# EAGLE board jr-support_v4 (EAGLE 8.2.2)
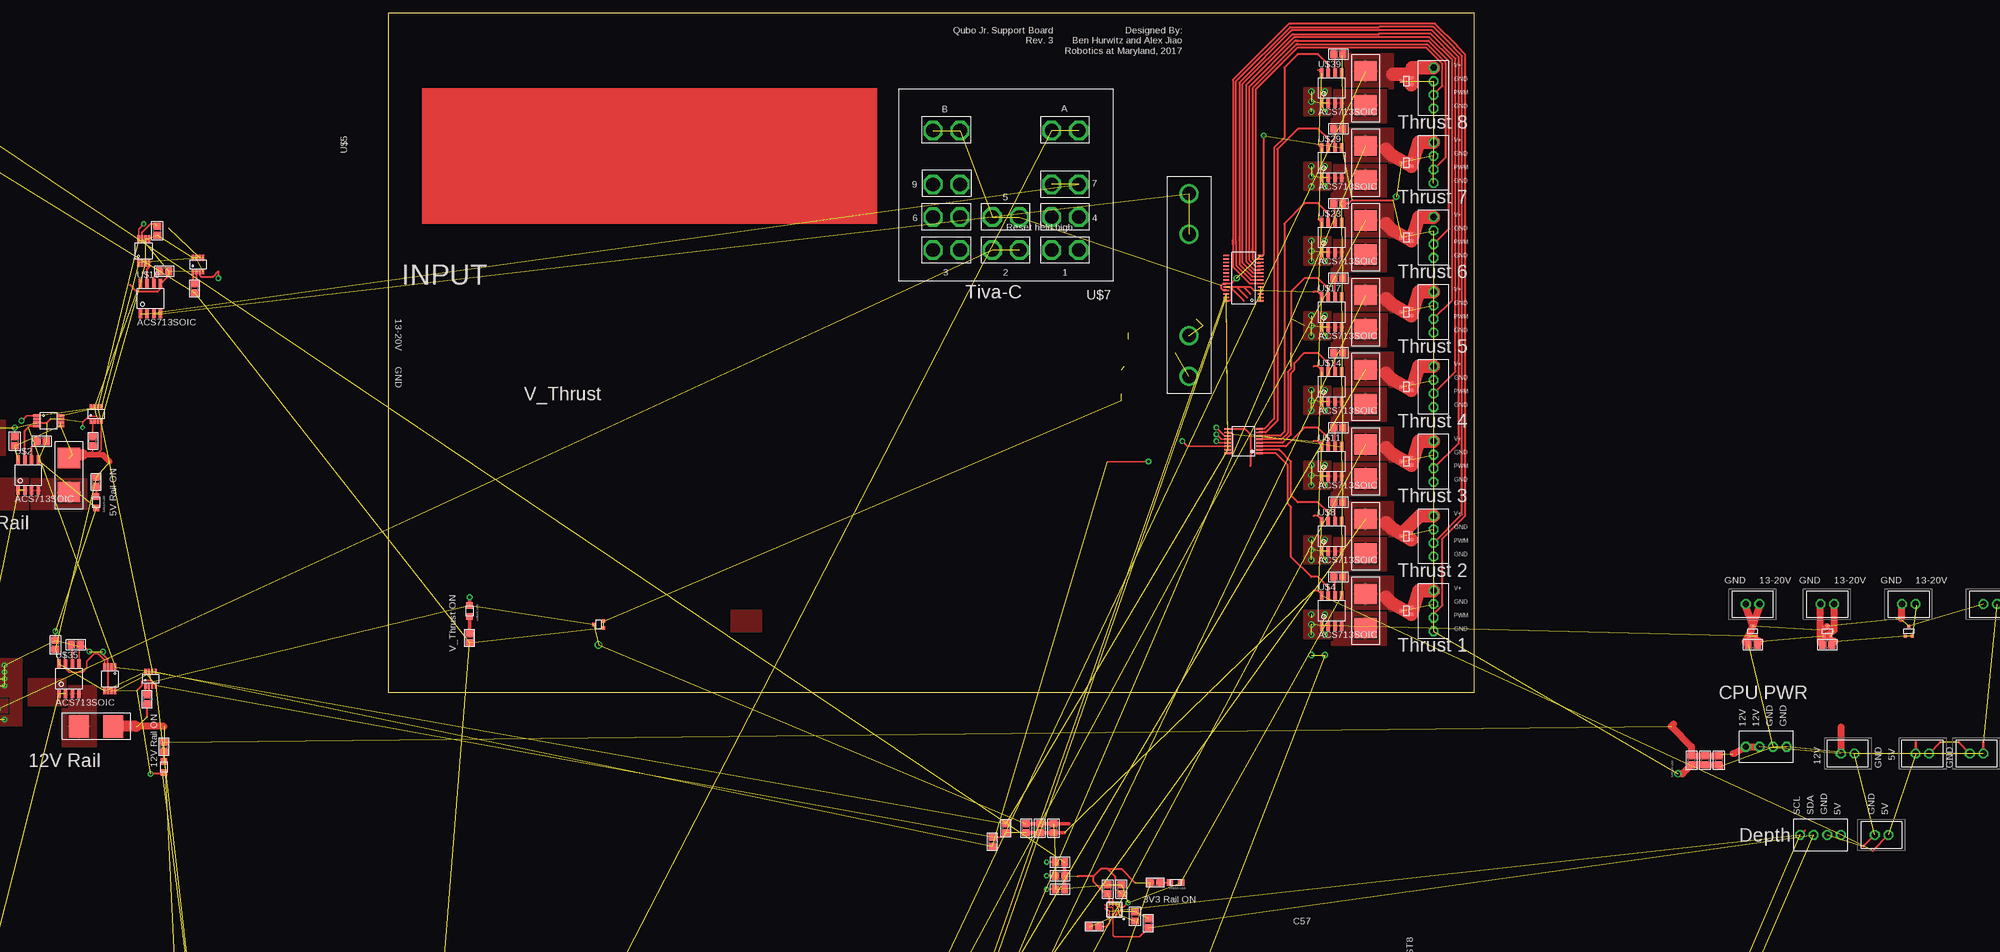
[diagram p9: board, top side]
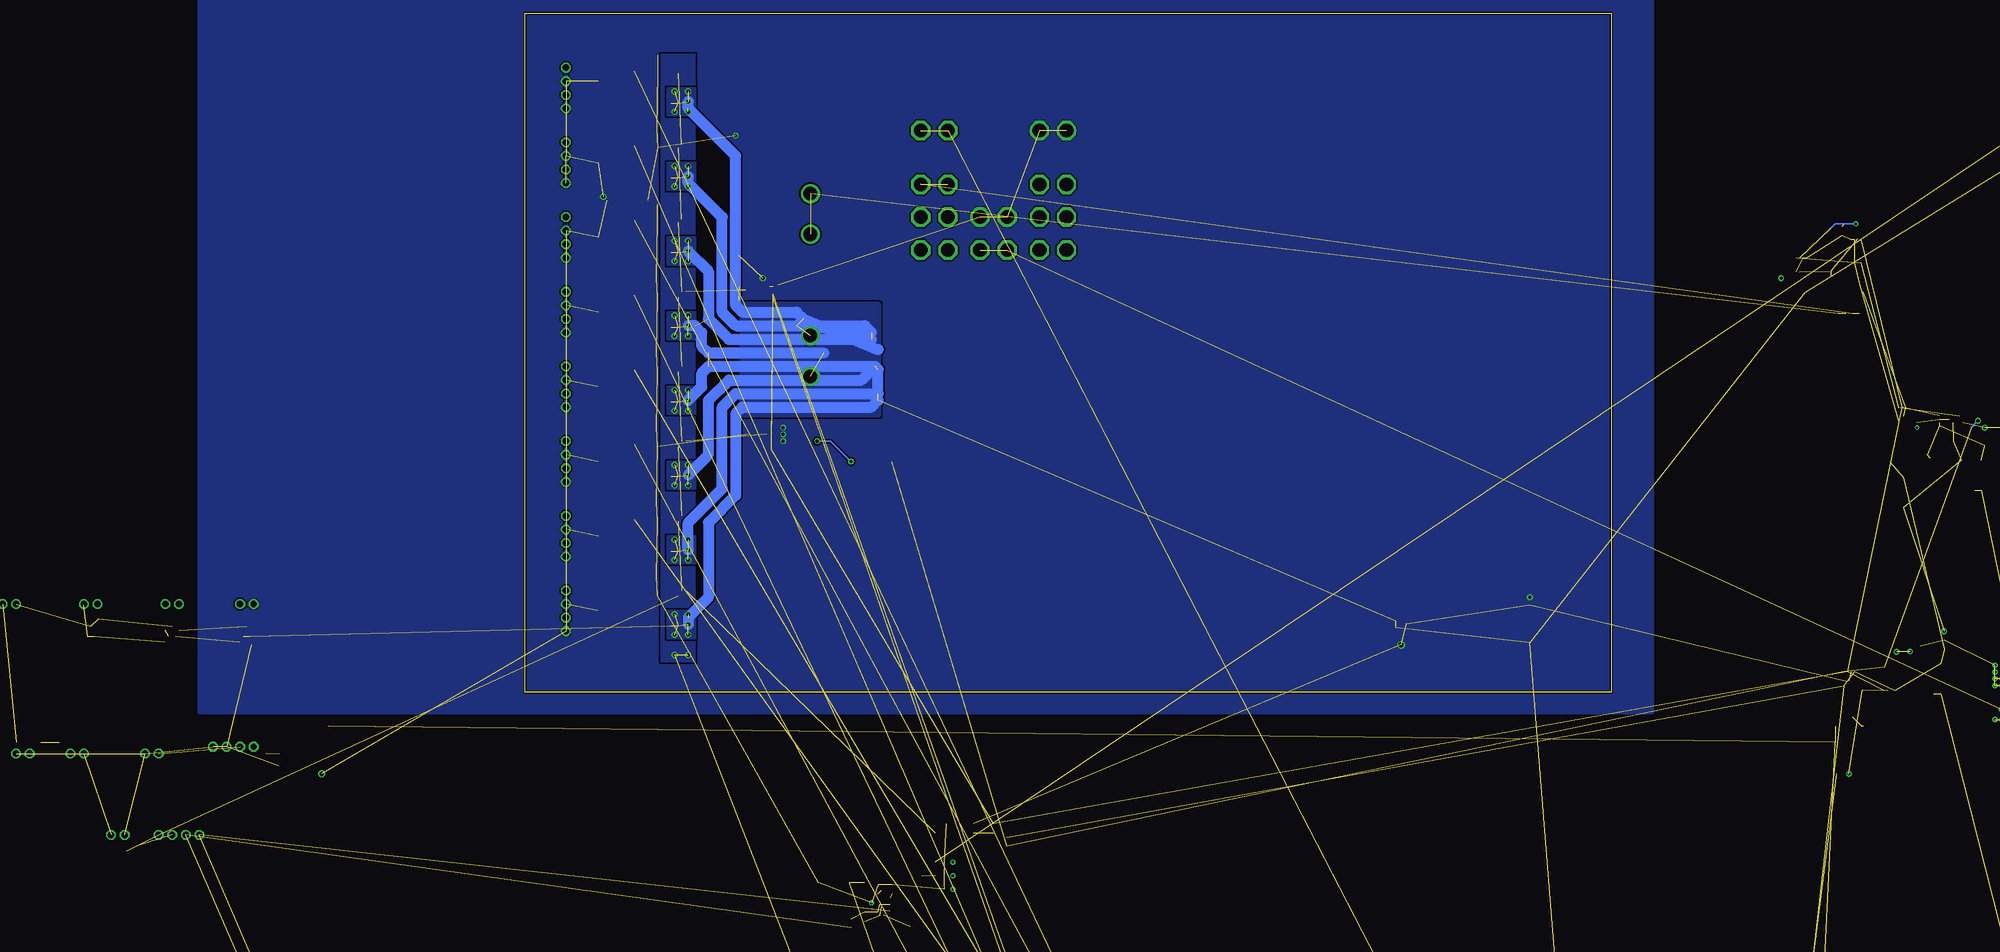
[diagram p10: board, bottom side, seen from below]

Size 203.18 x 127 mm. Coordinates in mm from the lower left corner, seen from the top.
Outline: 0,0 203.18,0 203.18,127 0,127 0,0
Copper layers (1*16): Top 0.035mm / dielectric 1.5mm / Bottom 0.035mm
Design rules "SparkFun *": minimum track width 8mil, minimum drill 15mil, track to track 8mil, track to pad 8mil, pad to pad 8mil, via to via 8mil, smd to smd 8mil, copper to edge 8mil, drill to drill 7mil, minimum pad ring 12mil, minimum via ring 10mil, stop-mask expansion 4mil, vias tented up to drill 20mil, thermal gap 10mil

## Footprints (pad centres in the part's own frame; a part is rotated, then mirrored left to right if it is on the bottom)
KK254_VERT_2PIN = drill 1.2 octagon: P$1 1.27,0; P$2 -1.27,0
0805 = smd 1.2 x 1.2: P$1 -1.05,0; P$2 1.05,0
VSSOP-8 = smd 0.42 x 1.45: P$1 -0.975,-2.2; P$2 -0.325,-2.2; P$3 0.325,-2.2; P$4 0.975,-2.2; P$5 0.975,2.2; P$6 0.325,2.2; P$7 -0.325,2.2; P$8 -0.975,2.2
SOT-23-8 = smd 0.45 x 1.1: P$1 -0.975,-1.3; P$2 -0.325,-1.3; P$3 0.325,-1.3; P$4 0.975,-1.3; P$5 0.975,1.3; P$6 0.325,1.3; P$7 -0.325,1.3; P$8 -0.975,1.3
BME280_LGA = smd 0.5 x 0.35: P$1 1.025,0.975; P$2 1.025,0.325; P$3 1.025,-0.325; P$4 1.025,-0.975; P$5 -1.025,-0.975; P$6 -1.025,-0.325; P$7 -1.025,0.325; P$8 -1.025,0.975
C0805 = smd 1.3 x 1.5: 1 -0.85,0; 2 0.85,0
CKR_D10 = drill 0.8 square: P$1 -2.5,0 | drill 0.8: P$2 2.5,0
140CLH-0810 = smd 3.5 x 2.5: + 3.25,0; - -3.25,0
C1210 = smd 1.6 x 2.7: 1 -1.4,0; 2 1.4,0
KK254_VERT_4PIN = drill 1.2 octagon: P$1 3.81,0; P$2 1.27,0; P$3 -1.27,0; P$4 -3.81,0
JP1 = drill 0.914 long: 1 0,-1.27; 2 0,1.27
1X02 = drill 1.016: 1 -1.27,0; 2 1.27,0
CHIPLED_0805 = smd 1.2 x 1.2: A 0,-1.05; C 0,1.05
SOT-346-3/S-MINI = smd 0.6 x 0.8: P$1 -0.95,-1; P$2 0.95,-1; P$3 0,1
RTRIM3314J = smd 1.3 x 2: 1 -1.8,-2; 3 1.8,-2 | smd 2 x 2: 2 0,2
R0805 = smd 1.3 x 1.5: 1 -0.85,0; 2 0.85,0
RC55 = drill 0.8 square: P$1 -5.1,0; P$2 5.1,0
V526-0 = drill 0.813 octagon: 1 -1.27,0; 2 1.27,0
TSSOP16 = smd 0.35 x 1.2: 1 -2.275,-2.925; 2 -1.625,-2.925; 3 -0.975,-2.925; 4 -0.325,-2.925; 5 0.325,-2.925; 6 0.975,-2.925; 7 1.625,-2.925; 8 2.275,-2.925; 9 2.275,2.925; 10 1.625,2.925; 11 0.975,2.925; 12 0.325,2.925; 13 -0.325,2.925; 14 -0.975,2.925; 15 -1.625,2.925; 16 -2.275,2.925
TSSOP-28_4MM = smd 1 x 0.3: 1 -3.2,4.225; 2 -3.2,3.575; 3 -3.2,2.925; 4 -3.2,2.275; 5 -3.2,1.625; 6 -3.2,0.975; 7 -3.2,0.325; 8 -3.2,-0.325; 9 -3.2,-0.975; 10 -3.2,-1.625; 11 -3.2,-2.275; 12 -3.2,-2.925; 13 -3.2,-3.575; 14 -3.2,-4.225; 15 3.2,-4.225; 16 3.2,-3.575; 17 3.2,-2.925; 18 3.2,-2.275; 19 3.2,-1.625; 20 3.2,-0.975; 21 3.2,-0.325; 22 3.2,0.325; 23 3.2,0.975; 24 3.2,1.625; 25 3.2,2.275; 26 3.2,2.925; 27 3.2,3.575; 28 3.2,4.225
DO-219AB = smd 1.3 x 1.4: P$1 -1.45,0; P$2 1.45,0
ACS713-SOIC = smd 0.65 x 1.75: P$1 -1.905,-2.8; P$2 -0.635,-2.8; P$3 0.635,-2.8; P$4 1.905,-2.8; P$5 1.905,2.8; P$6 0.635,2.8; P$7 -0.635,2.8; P$8 -1.905,2.8
534-5004 = drill 1.016: P$1 0,0
1.25"_FUSECLIPS = drill 2.54: P$1 -17.107,0; P$2 -9.487,0; P$3 9.487,0; P$4 17.107,0
154-OMNI-BLOK = smd 3.81 x 4.242: P$1 -3.188,0; P$2 3.188,0
KUHP_6.35MM-QUICK-CONNECT = drill 2.57 octagon: 1A -13.64,6.17; 1B -8.56,6.17; 2A -2.54,6.17; 2B 2.54,6.17; 3A 8.56,6.17; 3B 13.64,6.17; 4A -13.64,0; 4B -8.56,0; 5A -2.54,0; 5B 2.54,0; 6A 8.56,0; 6B 13.64,0; 7A -13.64,-6.1; 7B -8.56,-6.1; 9A 8.56,-6.1; 9B 13.64,-6.1; AA -13.64,-16.18; AB -8.56,-16.18; BA 8.56,-16.18; BB 13.64,-16.18
SOT323-R = smd 0.6 x 0.55: 1 -0.65,-0.925; 2 0.65,-0.925; 3 0,0.925
SOIC8+PAD = smd 0.5 x 1.15: 1 -1.9,2.54; 2 -0.63,2.54; 3 0.64,2.54; 4 1.91,2.54; 5 1.91,-2.54; 6 0.64,-2.54; 7 -0.63,-2.54; 8 -1.9,-2.54 | smd 3 x 2.65: PAD 0,0
PTN78060W = drill 1.397 octagon: P$1 -11.113,6.35; P$2 -11.113,-6.35; P$3 -1.587,-6.35; P$4 1.587,-6.35; P$5 4.763,-6.35; P$6 11.113,-6.35; P$7 11.113,6.35
MSOP16 = smd 0.305 x 0.889: DGATE -0.25,-2.39; ENOUT -0.75,2.39; FB -1.75,2.39; FLT -0.25,2.39; GND 0.25,2.39; HGATE 0.75,-2.39; NC -0.75,-2.39; NC1 1.25,-2.39; OUT -1.75,-2.39; OV 0.75,2.39; SENSE -1.25,-2.39; SHDN 1.75,2.39; SOURCE 0.25,-2.39; TMR -1.25,2.39; UV 1.25,2.39; VCC 1.75,-2.39
DPAK = smd 3 x 1.6: 1 1.57,-2.3; 3 1.57,2.3 | smd 6.7 x 6.7: TAB -5.08,0
SOT23 = smd 1 x 1.4: 1 -0.95,-1.1; 2 0.95,-1.1; 3 0,1.1
TSSOP5 = smd 0.3 x 0.6: P$1 -0.65,-1.125; P$2 0,-1.125; P$3 0.65,-1.125; P$4 0.65,1.125; P$5 -0.62,1.125
SOT-223 = smd 1.5 x 2: P$1 -2.3,-3.15; P$2 0,-3.15; P$3 2.3,-3.15 | smd 3.8 x 2: P$4 0,2.54
SOT-23-3 = smd 1.3 x 0.6: P$1 -1.05,0.95; P$2 -1.05,-0.95; P$3 1.05,0

## Placement (x,y rotation side)
2PIN_1  KK254_VERT_2PIN""  [KK254_VERT_2PIN]  -210.82,-529.59 0 top  (outside the outline)
2PIN_2  KK254_VERT_2PIN""  [KK254_VERT_2PIN]  -276.86,-1231.9 0 top  (outside the outline)
2PIN_3  KK254_VERT_2PIN""  [KK254_VERT_2PIN]  -276.86,-1250.95 0 top  (outside the outline)
2PIN_5  KK254_VERT_2PIN""  [KK254_VERT_2PIN]  -144.78,-905.51 0 top  (outside the outline)
3V3_LED  [0805]  147.32,-35.56 0 top  (outside the outline)
5V_CURR_ADC  ADC121C021  [VSSOP-8]  -63.5,50.8 270 top  (outside the outline)
5V_LED  [0805]  -54.61,35.56 270 top  (outside the outline)
5V_OUT  5V_OUT  [KK254_VERT_2PIN]  299.72,16.51 0 top  (outside the outline)
5V_VOLTAGE  INA219SOT23  [SOT-23-8]  -54.61,52.07 0 top  (outside the outline)
12V_CURR_ADC  ADC121C021  [VSSOP-8]  -52.07,2.54 180 top  (outside the outline)
12V_LED  [0805]  -41.91,-13.97 270 top  (outside the outline)
12V_OUT  12V_OUT  [KK254_VERT_2PIN]  273.05,-11.43 180 top  (outside the outline)
12V_VOLTAGE  INA219SOT23  [SOT-23-8]  -44.45,2.54 0 top  (outside the outline)
AUDIO  KK254_VERT_2PIN""  [KK254_VERT_2PIN]  -257.81,-969.01 0 top  (outside the outline)
AUDIO1  KK254_VERT_2PIN""  [KK254_VERT_2PIN]  -232.41,-969.01 0 top  (outside the outline)
BATT1_IN  KK254_VERT_2PIN""  [KK254_VERT_2PIN]  -257.81,-786.13 0 top  (outside the outline)
BATT2_IN  KK254_VERT_2PIN""  [KK254_VERT_2PIN]  -257.81,-805.18 0 top  (outside the outline)
BME280  BME280  [BME280_LGA]  135.89,-40.64 270 top  (outside the outline)
C1  0.1u  [C0805]  -62.23,8.89 90 top  (outside the outline)
C2  0.1u  [C0805]  -69.85,46.99 90 top  (outside the outline)
C3  47n  [C0805]  -64.77,46.99 0 top  (outside the outline)
C4  0.22u  [C0805]  -254,-995.68 0 top  (outside the outline)
C5  0.1u  [C0805]  -20.32,-407.67 0 top  (outside the outline)
C6  47n  [C0805]  177.8,21.59 0 top
C7  0.1u  [C0805]  -20.32,-414.02 0 top  (outside the outline)
C8  0.1u  [C0805]  -20.32,-264.16 0 top  (outside the outline)
C9  47n  [C0805]  177.8,35.56 0 top
C10  0.1u  [C0805]  -15.24,-264.16 0 top  (outside the outline)
C11  0.1u  [C0805]  -20.32,-420.37 0 top  (outside the outline)
C12  47n  [C0805]  177.8,49.53 0 top
C13  0.1u  [C0805]  -20.32,-426.72 0 top  (outside the outline)
C14  0.1u  [C0805]  -20.32,-433.07 0 top  (outside the outline)
C15  47n  [C0805]  177.8,63.5 0 top
C16  0.1u  [C0805]  -20.32,-439.42 0 top  (outside the outline)
C17  0.1u  [C0805]  -20.32,-445.77 0 top  (outside the outline)
C18  47n  [C0805]  177.8,77.47 0 top
C19  0.1u  [C0805]  -20.32,-232.41 0 top  (outside the outline)
C20  47n  [C0805]  -41.91,78.74 0 top  (outside the outline)
C21  0.1u  [C0805]  -20.32,-452.12 0 top  (outside the outline)
C22  0.1u  [C0805]  -20.32,-458.47 0 top  (outside the outline)
C23  0.1u  [C0805]  -219.71,-556.26 0 top  (outside the outline)
C24  100n  [C0805]  137.16,-36.83 90 top  (outside the outline)
C25  100n  [C0805]  134.62,-36.83 90 top  (outside the outline)
C26  100n  [C0805]  139.7,-41.91 270 top  (outside the outline)
C27  0.22u  [C0805]  -247.65,-995.68 0 top  (outside the outline)
C28  22u  [C0805]  -231.14,-1002.03 0 top  (outside the outline)
C29  47n  [C0805]  177.8,91.44 0 top
C30  4.7n  [C0805]  -219.71,-562.61 0 top  (outside the outline)
C31  47n  [C0805]  -58.42,8.89 0 top  (outside the outline)
C33  0.1u  [C0805]  -219.71,-568.96 0 top  (outside the outline)
C34  1u  [C0805]  -226.06,-1002.03 0 top  (outside the outline)
C35  1u  [C0805]  -220.98,-1002.03 0 top  (outside the outline)
C36  1u  [C0805]  -215.9,-1002.03 0 top  (outside the outline)
C37  47n  [C0805]  177.8,105.41 0 top
C38  330 uF  [CKR_D10]  -259.08,-737.87 0 top  (outside the outline)
C40  .1 uF  [C0805]  -232.41,-734.06 0 top  (outside the outline)
C43  100u  [140CLH-0810]  -227.33,-581.66 0 top  (outside the outline)
C44  100u  [140CLH-0810]  -227.33,-590.55 0 top  (outside the outline)
C45  1n  [C0805]  248.92,-12.7 270 top  (outside the outline)
C46  0.1u  [C0805]  255.27,8.89 180 top  (outside the outline)
C47  0.1u  [C0805]  269.24,8.89 180 top  (outside the outline)
C48  10u  [C0805]  -233.68,-598.17 0 top  (outside the outline)
C49  10u  [C0805]  -233.68,-604.52 0 top  (outside the outline)
C50  330 uF  [CKR_D10]  -259.08,-664.21 0 top  (outside the outline)
C51  .1 uF  [C0805]  -266.7,-674.37 0 top  (outside the outline)
C53  4.7u  [C0805]  119.38,-25.4 90 top  (outside the outline)
C57  47n  [C0805]  177.8,119.38 0 top
C59  0.1u  [C0805]  -20.32,-194.31 0 top  (outside the outline)
C60  1u  [C0805]  -210.82,-1002.03 0 top  (outside the outline)
C61  10u  [C0805]  -205.74,-1002.03 0 top  (outside the outline)
C62  10u  [C0805]  -200.66,-1002.03 0 top  (outside the outline)
C64  0.1u  [C0805]  -20.32,-200.66 0 top  (outside the outline)
C65  22u  [C0805]  -195.58,-1002.03 0 top  (outside the outline)
C66  1u  [C0805]  -20.32,-207.01 0 top  (outside the outline)
C69  0.1u  [C0805]  -20.32,-213.36 0 top  (outside the outline)
C70  0.1u  [C0805]  -20.32,-219.71 0 top  (outside the outline)
C71  0.1u  [C0805]  -20.32,-226.06 0 top  (outside the outline)
C72  0.1u  [C0805]  -20.32,-238.76 0 top  (outside the outline)
C73  0.1u  [C0805]  -20.32,-245.11 0 top  (outside the outline)
C74  0.1u  [C0805]  -20.32,-251.46 0 top  (outside the outline)
C75  10u  [C0805]  -20.32,-257.81 0 top  (outside the outline)
C76  10u  [C0805]  -20.32,-270.51 0 top  (outside the outline)
C77  0.1u  [C0805]  246.38,-12.7 270 top  (outside the outline)
C78  4.7u  [C0805]  243.84,-12.7 270 top  (outside the outline)
C79  0.1u  [C0805]  -20.32,-276.86 0 top  (outside the outline)
C80  0.1u  [C0805]  -15.24,-276.86 0 top  (outside the outline)
C81  0.1u  [C0805]  121.92,-25.4 90 top  (outside the outline)
C82  1n  [C0805]  124.46,-25.4 90 top  (outside the outline)
C83  4.7u  [C0805]  125.73,-36.83 180 top  (outside the outline)
C84  0.1u  [C0805]  125.73,-34.29 180 top  (outside the outline)
C85  1n  [C0805]  125.73,-31.75 180 top  (outside the outline)
C88  10u  [C0805]  -20.32,-283.21 0 top  (outside the outline)
C93  1u  [C0805]  -43.18,86.36 90 top  (outside the outline)
C94  0.1u  [C0805]  -20.32,-302.26 0 top  (outside the outline)
C101  0.1u  [C0805]  -20.32,-289.56 0 top  (outside the outline)
C102  10u  [C0805]  -20.32,-295.91 0 top  (outside the outline)
C103  0.1u  [C0805]  -20.32,-308.61 0 top  (outside the outline)
C104  0.1u  [C0805]  -20.32,-314.96 0 top  (outside the outline)
C105  10u  [C0805]  -20.32,-321.31 0 top  (outside the outline)
C106  0.1u  [C0805]  -20.32,-327.66 0 top  (outside the outline)
C107  0.1u  [C0805]  -20.32,-334.01 0 top  (outside the outline)
C108  10u  [C0805]  -20.32,-340.36 0 top  (outside the outline)
C109  0.1u  [C0805]  -20.32,-346.71 0 top  (outside the outline)
C110  0.1u  [C0805]  -20.32,-353.06 0 top  (outside the outline)
C111  10u  [C0805]  -20.32,-359.41 0 top  (outside the outline)
C112  0.1u  [C0805]  -20.32,-365.76 0 top  (outside the outline)
C113  0.1u  [C0805]  -20.32,-372.11 0 top  (outside the outline)
C114  10u  [C0805]  -20.32,-378.46 0 top  (outside the outline)
CAMERA1  KK254_VERT_2PIN""  [KK254_VERT_2PIN]  255.27,16.51 0 top  (outside the outline)
CAMERA2  KK254_VERT_2PIN""  [KK254_VERT_2PIN]  269.24,16.51 0 top  (outside the outline)
CIN1  2.2 uF  [C1210]  -242.57,-636.27 0 top  (outside the outline)
CIN2  2.2 uF  [C1210]  -251.46,-636.27 0 top  (outside the outline)
CIN3  2.2 uF  [C1210]  -246.38,-735.33 0 top  (outside the outline)
CIN4  2.2 uF  [C1210]  -238.76,-735.33 0 top  (outside the outline)
CPU_PWR  CPU PWR  [KK254_VERT_4PIN]  257.81,-10.16 0 top  (outside the outline)
DEPTH_SENS  Depth Sensor  [KK254_VERT_4PIN]  267.97,-26.67 180 top  (outside the outline)
ETHERNET  KK254_VERT_2PIN""  [KK254_VERT_2PIN]  287.02,-11.43 180 top  (outside the outline)
FAN1  KK254_VERT_2PIN""  [KK254_VERT_2PIN]  279.4,-26.67 0 top  (outside the outline)
FAN2  KK254_VERT_2PIN""  [KK254_VERT_2PIN]  297.18,-11.43 0 top  (outside the outline)
JP1  [JP1]  -261.62,-632.46 0 top  (outside the outline)
JP2  [JP1]  -261.62,-721.36 0 top  (outside the outline)
JP3  [1X02]  -208.28,-969.01 0 top  (outside the outline)
JP4  [1X02]  -278.13,-1207.77 0 top  (outside the outline)
JP5  [1X02]  -278.13,-1268.73 0 top  (outside the outline)
JP6  [1X02]  -278.13,-1285.24 0 top  (outside the outline)
LED1  Red  [0805]  -134.62,-1000.76 0 top  (outside the outline)
LED3  Red  [0805]  -265.43,-1007.11 0 top  (outside the outline)
LED4  Green  [CHIPLED_0805]  -129.54,-982.98 0 top  (outside the outline)
LED5  Green  [0805]  -259.08,-1007.11 0 top  (outside the outline)
LED6  Yellow  [0805]  -252.73,-1007.11 0 top  (outside the outline)
LED7  Yellow  [0805]  -246.38,-1007.11 0 top  (outside the outline)
LED8  Green  [0805]  -240.03,-1007.11 0 top  (outside the outline)
LED9  Green  [0805]  -233.68,-1007.11 0 top  (outside the outline)
PMOS1  SSM3J353F  [SOT-346-3/S-MINI]  -264.16,-995.68 0 top  (outside the outline)
PMOS2  SSM3J353F  [SOT-346-3/S-MINI]  -257.81,-995.68 0 top  (outside the outline)
R2  [RTRIM3314J]  -274.32,-1193.8 0 top  (outside the outline)
R3  [RTRIM3314J]  -283.21,-1193.8 0 top  (outside the outline)
R4  10k  [R0805]  -219.71,-575.31 0 top  (outside the outline)
R5  21kO  [RC55]  -256.54,-648.97 0 top  (outside the outline)
R6  2.61kO  [RC55]  -241.3,-718.82 0 top  (outside the outline)
R7  4.7k  [R0805]  115.57,-25.4 270 top  (outside the outline)
R8  4.7k  [R0805]  113.03,-27.94 90 top  (outside the outline)
R9  12k  [R0805]  -190.5,-1002.03 0 top  (outside the outline)
R10  4.2k  [R0805]  142.24,-43.18 90 top  (outside the outline)
R11  4.2k  [R0805]  132.08,-43.81 180 top  (outside the outline)
R12  5m  [R0805]  -176.53,-995.68 0 top  (outside the outline)
R13  20.8k  [R0805]  -241.3,-995.68 0 top  (outside the outline)
R14  51k  [R0805]  -171.45,-995.68 0 top  (outside the outline)
R15  5m  [R0805]  -166.37,-995.68 0 top  (outside the outline)
R16  10\  [R0805]  -161.29,-995.68 0 top  (outside the outline)
R17  200k  [R0805]  -234.95,-995.68 0 top  (outside the outline)
R19  8.2k  [R0805]  -222.25,-995.68 0 top  (outside the outline)
R20  5.1k  [R0805]  -217.17,-995.68 0 top  (outside the outline)
R22  510  [R0805]  -156.21,-995.68 0 top  (outside the outline)
R23  51k  [R0805]  -151.13,-995.68 0 top  (outside the outline)
R24  5.1k  [R0805]  -212.09,-995.68 0 top  (outside the outline)
R25  10  [R0805]  -45.09,-1.27 90 top  (outside the outline)
R26  10\  [R0805]  -146.05,-995.68 0 top  (outside the outline)
R27  200k  [R0805]  -228.6,-995.68 0 top  (outside the outline)
R28  8.2k  [R0805]  -207.01,-995.68 0 top  (outside the outline)
R29  6.8k  [R0805]  -201.93,-995.68 0 top  (outside the outline)
R30  10  [R0805]  -36.2,75.56 90 top  (outside the outline)
R31  270  [R0805]  -54.61,39.37 90 top  (outside the outline)
R32  1.5k  [R0805]  15.24,10.16 270 top
R33  1.2k  [R0805]  -41.91,-10.16 90 top  (outside the outline)
R34  68  [R0805]  143.51,-35.56 180 top  (outside the outline)
R35  10  [R0805]  -55.24,46.99 90 top  (outside the outline)
R36  1MO  [R0805]  -140.97,-995.68 0 top  (outside the outline)
R37  430  [R0805]  -135.89,-995.68 0 top  (outside the outline)
R39  330  [R0805]  -130.81,-995.68 0 top  (outside the outline)
R41  1MO  [R0805]  -266.7,-1002.03 0 top  (outside the outline)
R42  430  [R0805]  -261.62,-1002.03 0 top  (outside the outline)
R43  330  [R0805]  -256.54,-1002.03 0 top  (outside the outline)
R44  1.2k  [R0805]  -196.85,-995.68 0 top  (outside the outline)
R45  1MO  [R0805]  -251.46,-1002.03 0 top  (outside the outline)
R46  1.2k  [R0805]  -191.77,-995.68 0 top  (outside the outline)
R47  1MO  [R0805]  -246.38,-1002.03 0 top  (outside the outline)
R48  330  [R0805]  -241.3,-1002.03 0 top  (outside the outline)
R49  330  [R0805]  -236.22,-1002.03 0 top  (outside the outline)
R50  1.5k  [R0805]  -186.69,-995.68 0 top  (outside the outline)
R51  1.5k  [R0805]  -181.61,-995.68 0 top  (outside the outline)
SHORE_IN  KK254_VERT_2PIN""  [KK254_VERT_2PIN]  -257.81,-824.23 0 top  (outside the outline)
TEST-PTS  0  [V526-0]  -190.5,-967.74 0 top  (outside the outline)
TEST-PTS1  0  [V526-0]  -172.72,-967.74 0 top  (outside the outline)
THRUST1  KK254_VERT_4PIN22-29-2041  [KK254_VERT_4PIN]  195.58,15.24 270 top
THRUST2  KK254_VERT_4PIN22-29-2041  [KK254_VERT_4PIN]  195.58,29.21 270 top
THRUST3  KK254_VERT_4PIN22-29-2041  [KK254_VERT_4PIN]  195.58,43.18 270 top
THRUST4  KK254_VERT_4PIN22-29-2041  [KK254_VERT_4PIN]  195.58,57.15 270 top
THRUST5  KK254_VERT_4PIN22-29-2041  [KK254_VERT_4PIN]  195.58,71.12 270 top
THRUST6  KK254_VERT_4PIN22-29-2041  [KK254_VERT_4PIN]  195.58,85.09 270 top
THRUST7  KK254_VERT_4PIN22-29-2041  [KK254_VERT_4PIN]  195.58,99.06 270 top
THRUST8  KK254_VERT_4PIN22-29-2041  [KK254_VERT_4PIN]  195.58,113.03 270 top
THRUSTER_CURR_ADC  ADS7828  [TSSOP16]  160.02,46.99 90 top
U1  PCA9685  [TSSOP-28_4MM]  160.02,77.47 180 top
U$1  VTVSDO-219AB  [DO-219AB]  -265.43,-1032.51 0 top  (outside the outline)
U$2  ACS713SOIC  [ACS713-SOIC]  -67.31,40.64 0 top  (outside the outline)
U$3  TEST_PT534-5004  [534-5004]  -279.4,241.3 0 top  (outside the outline)
U$4  ACS713SOIC  [ACS713-SOIC]  176.53,15.24 0 top
U$5  25A Fuse  [1.25"_FUSECLIPS]  149.86,76.2 270 top
U$6  4A Fuse  [154-OMNI-BLOK]  182.88,15.24 90 top
U$7  KUHP-5XX1-XX  [KUHP_6.35MM-QUICK-CONNECT]  115.57,88.9 180 top
U$8  ACS713SOIC  [ACS713-SOIC]  176.53,29.21 0 top
U$9  4A Fuse  [154-OMNI-BLOK]  182.88,29.21 90 top
U$10  VTVSSOT323  [SOT323-R]  190.5,114.3 90 top
U$11  ACS713SOIC  [ACS713-SOIC]  176.53,43.18 0 top
U$12  4A Fuse  [154-OMNI-BLOK]  182.88,43.18 90 top
U$13  VTVSSOT323  [SOT323-R]  190.5,85.09 90 top
U$14  ACS713SOIC  [ACS713-SOIC]  176.53,57.15 0 top
U$15  4A Fuse  [154-OMNI-BLOK]  182.88,57.15 90 top
U$16  VTVSSOT323  [SOT323-R]  190.5,99.06 90 top
U$17  ACS713SOIC  [ACS713-SOIC]  176.53,71.12 0 top
U$18  4A Fuse  [154-OMNI-BLOK]  182.88,71.12 90 top
U$19  ACS713SOIC  [ACS713-SOIC]  -44.45,73.66 0 top  (outside the outline)
U$20  4A Fuse  [154-OMNI-BLOK]  -59.69,40.64 90 top  (outside the outline)
U$21  VTVSSOT323  [SOT323-R]  -218.44,-541.02 0 top  (outside the outline)
U$22  VTVSSOT323  [SOT323-R]  190.5,71.12 90 top
U$23  ACS713SOIC  [ACS713-SOIC]  176.53,85.09 0 top
U$24  BTS5090-1EJA  [SOIC8+PAD]  -215.9,-548.64 0 top  (outside the outline)
U$25  PTN78060W  [PTN78060W]  -214.63,-624.84 0 top  (outside the outline)
U$26  VTVSSOT323  [SOT323-R]  190.5,43.18 90 top
U$27  4A Fuse  [154-OMNI-BLOK]  182.88,85.09 90 top
U$28  VTVSSOT323  [SOT323-R]  190.5,57.15 90 top
U$29  ACS713SOIC  [ACS713-SOIC]  176.53,99.06 0 top
U$30  VTVSSOT323  [SOT323-R]  190.5,29.21 90 top
U$31  VTVSSOT323  [SOT323-R]  190.5,15.24 90 top
U$32  VTVSSOT323  [SOT323-R]  255.27,11.43 0 top  (outside the outline)
U$33  VTVSSOT323  [SOT323-R]  269.24,11.43 0 top  (outside the outline)
U$34  VTVSSOT323  [SOT323-R]  284.48,11.43 0 top  (outside the outline)
U$35  ACS713SOIC  [ACS713-SOIC]  -59.69,2.54 0 top  (outside the outline)
U$36  4A Fuse  [154-OMNI-BLOK]  -54.61,-6.35 0 top  (outside the outline)
U$37  4A Fuse  [154-OMNI-BLOK]  182.88,99.06 90 top
U$38  VTVSSOT323  [SOT323-R]  39.37,12.7 90 top
U$39  ACS713SOIC  [ACS713-SOIC]  176.53,113.03 0 top
U$40  4A Fuse  [154-OMNI-BLOK]  182.88,113.03 90 top
U$41  PTN78060W  [PTN78060W]  -247.65,-694.69 0 top  (outside the outline)
U$42  VTVSSOT323  [SOT323-R]  -266.7,-748.03 0 top  (outside the outline)
U$43  VTVSSOT323  [SOT323-R]  -266.7,-754.38 0 top  (outside the outline)
U$44  VTVSSOT323  [SOT323-R]  -266.7,-760.73 0 top  (outside the outline)
U$45  VTVSDO-219AB  [DO-219AB]  -284.48,-1219.2 0 top  (outside the outline)
U$46  VTVSSOT323  [SOT323-R]  -266.7,-767.08 0 top  (outside the outline)
U$47  VTVSSOT323  [SOT323-R]  -266.7,-773.43 0 top  (outside the outline)
U$48  LTC4364MSOP  [MSOP16]  -182.88,-984.25 0 top  (outside the outline)
U$49  STD95N2LH5  [DPAK]  -147.32,-967.74 0 top  (outside the outline)
U$50  STD95N2LH5  [DPAK]  -252.73,-985.52 0 top  (outside the outline)
U$51  LTC4364MSOP  [MSOP16]  -173.99,-984.25 0 top  (outside the outline)
U$52  STD95N2LH5  [DPAK]  -229.87,-985.52 0 top  (outside the outline)
U$53  STD95N2LH5  [DPAK]  -207.01,-985.52 0 top  (outside the outline)
U$54  TEST_PT534-5004  [534-5004]  -279.4,224.79 0 top  (outside the outline)
U$55  BSS138CT-NDSOT23  [SOT23]  -166.37,-981.71 0 top  (outside the outline)
U$56  74LVC1G14  [TSSOP5]  -140.97,-1002.03 0 top  (outside the outline)
U$57  NCP1117  [SOT-223]  -193.04,-982.98 0 top  (outside the outline)
U$58  BSS138CT-NDSOT23  [SOT23]  -148.59,-981.71 0 top  (outside the outline)
U$60  TL431DBZ  [SOT-23-3]  -184.15,-1002.03 0 top  (outside the outline)
U$61  TL431DBZ  [SOT-23-3]  -176.53,-1002.03 0 top  (outside the outline)
U$62  VTVSSOT323  [SOT323-R]  -266.7,-1038.86 0 top  (outside the outline)
U$63  VTVSDO-219AB  [DO-219AB]  -265.43,-1022.35 0 top  (outside the outline)
U$64  VTVSDO-219AB  [DO-219AB]  -265.43,-1027.43 0 top  (outside the outline)
U$66  VTVSDO-219AB  [DO-219AB]  -265.43,-1051.56 0 top  (outside the outline)
U$67  VTVSSOT323  [SOT323-R]  -266.7,-1057.91 0 top  (outside the outline)
U$68  VTVSSOT323  [SOT323-R]  -266.7,-1064.26 0 top  (outside the outline)
U$69  TEST_PT534-5004  [534-5004]  -260.35,-1075.69 0 top  (outside the outline)
U$70  TEST_PT534-5004  [534-5004]  -260.35,-1092.2 0 top  (outside the outline)
U$71  TEST_PT534-5004  [534-5004]  -260.35,-1108.71 0 top  (outside the outline)
U$72  TEST_PT534-5004  [534-5004]  -260.35,-1125.22 0 top  (outside the outline)
U$73  TEST_PT534-5004  [534-5004]  -260.35,-1141.73 0 top  (outside the outline)
U$74  TEST_PT534-5004  [534-5004]  -260.35,-1158.24 0 top  (outside the outline)
U$75  TEST_PT534-5004  [534-5004]  -260.35,-1174.75 0 top  (outside the outline)
U$76  TEST_PT534-5004  [534-5004]  -260.35,-1191.26 0 top  (outside the outline)
V-THRUST_CURR_ADC  ADC121C021  [VSSOP-8]  -45.72,82.55 0 top  (outside the outline)
V-THRUST_LED  [0805]  15.24,15.24 90 top
V-THRUST_OUT  Vin_OUT  [KK254_VERT_2PIN]  284.48,16.51 0 top  (outside the outline)
V-THRUST_VOLTAGE  INA219SOT23  [SOT-23-8]  -35.56,80.01 0 top  (outside the outline)

## Tracks (layer width: path | path; a pad name or v marks a point on that pad's centre or on a via)
5V  (via drill 0.65)  (8 unrouted)
  other vias: 172.72,6.99 175.26,6.99
  pour Bottom (isolate 0.305, rank 2): 171.45,119.38 177.8,119.38 177.8,5.71 171.45,5.71
5V_CURR  (5 unrouted)
  pour Top (isolate 0.305, rank 2): -71.75,44.45 -71.75,50.8 -77.47,50.8 -77.47,44.45
  pour Top (isolate 0.305, rank 2): -67.31,34.29 -67.31,40.01 -73.03,40.01 -73.03,34.29
12V_CURR  (5 unrouted)
  pour Top (isolate 0.305): -60.33,-2.54 -67.31,-2.54 -67.31,2.54 -60.33,2.54
+3V3  (12 unrouted)
  Top 0.406: 137.26,-41.06 137.21,-41.01 136.52,-41.01 136.28,-41.25 136.28,-41.6 BME280.P$2 | 136.52,-37.04 136.24,-37.04 136,-36.8 136,-34.4 134.62,-33.02 | BME280.P$6 135.56,-38.62 | BME280.P$5 134.91,-38.4 131.97,-35.45 131.97,-34.4 | 131.97,-34.4 133.35,-33.02 134.62,-33.02 | 134.62,-33.02 137.16,-33.02 139.7,-35.56 | 131.97,-34.4 129.01,-34.4
  Top 0.61: C85.1 C84.1 C83.1
+5V  (80 unrouted)
  Top 0.254: 157.24,48.47 157.83,48.47 158.03,48.28 158.03,45.05 157.83,44.86 157.24,44.86 THRUSTER_CURR_ADC.16 | R8.2 114.73,-27.09 R7.2
  Top 0.305: R35.1 -55.24,45.09 -55.88,44.45 | 5V_VOLTAGE.P$4 -53.63,45.42 -54.61,44.45
  Top 0.406: 160.02,75.84 161.29,75.84 161.94,75.19 | 158.75,75.84 160.02,75.84 | 157.48,75.84 158.75,75.84 | 161.32,74.55 160.02,75.84 | 160.7,73.89 158.75,75.84 | 160.08,73.25 157.48,75.84 | U1.28 156.91,73.34 157.49,73.34 157.73,73.58 157.73,75.51 157.48,75.76 157.48,75.84 | U$8.P$8 174.62,32.38 173.99,33.02 173.14,33.02 | U$29.P$8 174.03,102.45 | 174.03,116.42 U$39.P$8 | 174.03,88.48 U$23.P$8 | U$17.P$8 174.62,74.3 173.99,74.93 173.14,74.93 | U$11.P$8 174.62,46.35 173.99,46.99 173.14,46.99 | U$14.P$8 174.62,60.33 173.99,60.96 173.14,60.96 | U$4.P$8 174.62,18.41 173.99,19.05 173.14,19.05 | -55.56,44.77 -55.88,44.45 -55.56,44.13 | -53.66,44.13 -53.34,44.45 -53.66,44.77
  Top 0.508: 277.71,-29.63 FAN1.P$1 | ETHERNET.P$1 285.75,-9.31 | FAN2.P$1 298.45,-9.31
  Top 0.61: C53.1 C81.1 C82.1 126.58,-26.25
  Top 1.016: -57.15,44.45 -55.88,44.45 -54.61,44.45 -53.34,44.45 -52.07,43.18
  Top 2.032: -59.07,44.45 -57.15,44.45
+12V  (15 unrouted)
  Top 0.406: -45.09,-4.6 R25.1
  Top 1.27: -41.91,-6.35 -46.84,-6.35 | 249.19,-11.59 C45.1 C77.1 C78.1 243.84,-10.16 240.03,-6.35 240.45,-5.93 | 251.62,-11.43 CPU_PWR.P$4 CPU_PWR.P$3 | 271.78,-6.5 12V_OUT.P$1
  Top 2.032: -47.15,-6.35 U$36.P$2 -52.07,-6.35
GND  (via drill 0.35, 0.45, 0.55, 0.6, 0.65, 0.8, 0.9)  (249 unrouted)
  Top 0.254: C2.2 v-69.85,49.53 | THRUSTER_CURR_ADC.13 155.26,46.66 v154.94,46.99 | THRUSTER_CURR_ADC.12 155.88,47.31 v154.94,48.26 | v154.94,49.53 156.16,48.3 156.5,47.97 THRUSTER_CURR_ADC.11 | BME280.P$7 136.33,-39.73 136.33,-39.97 136.55,-40.2 137.6,-40.2 v138.43,-39.37
  Top 0.305: U$35.P$5 -57.78,8.68 C31.2 -57.15,8.89 v-55.88,7.62 | C1.2 v-62.23,11.43 | 5V_VOLTAGE.P$3 -54.35,50.84 -54.35,51.47 -54.56,51.68 -55.96,51.68 -57.15,50.48 v-57.15,49.53
  Top 0.406: 178.44,119.17 C57.2 | 178.44,91.22 C29.2 179.71,91.44 180.34,92.08 187.96,92.08 v188.59,92.71 | U1.25 156.78,75.23 156.21,75.23 155.91,75.53 155.91,76.16 156.21,76.45 156.78,76.45 U1.23 157.78,76.5 v158.75,77.47 | THRUSTER_CURR_ADC.9 160.28,49.27 161.29,48.26 161.29,42.33 | 5V_CURR_ADC.P$3 -63.83,50.48 -63.17,51.12 | 12V_VOLTAGE.P$3 -44.14,1.26 -44.14,1.96 -44.38,2.2 -45.82,2.2 -46.06,1.96 -46.06,1.27 -46.91,0.42 | 12V_LED.P$2 -42.13,-15.24 v-44.45,-15.24 | -52.4,0.99 12V_CURR_ADC.P$6 | -52.4,0.99 12V_CURR_ADC.P$3 -52.43,4.77 -52.43,6.21 -53.34,7.12 v-53.34,7.62 | 12V_CURR_ADC.P$7 -52.4,0.99 | 5V_VOLTAGE.P$7 5V_VOLTAGE.P$8 | C85.2 v123.19,-31.75 | C84.2 v123.19,-34.29 | C83.2 v123.19,-36.83 | -48.26,76.2 -46.99,74.93 -43.18,74.93 -42.55,75.56 U$19.P$5 -41.06,77.94 | V-THRUST_CURR_ADC.P$7 -46.05,86.03 -44.45,87.63 -43.6,87.63 | v-31.75,77.47 -31.75,78.74 -32.74,77.75 -34.98,77.75 -35.22,77.99 -35.22,78.69 V-THRUST_VOLTAGE.P$3 | U1.14 163.61,81.69 163.83,81.92 v163.83,104.14
  Top 0.508: 290.41,-9.31 ETHERNET.P$2 | 293.79,-9.31 FAN2.P$2 | 276.01,-28.79 FAN1.P$2
  Top 0.61: C53.2 C81.2 C82.2 127.42,-24.55 | V-THRUST_LED.P$2 v15.24,17.78
  Top 1.27: 249.19,-13.81 C45.2 C77.2 C78.2 242.15,-15.24 v241.3,-15.24 | 283.03,13.79 283.21,13.97 V-THRUST_OUT.P$2 | 267.97,11.61 U$33.3 | 267.97,11.61 CAMERA2.P$2 | C47.2 267.97,9.31 267.97,11.61 | C46.2 253.82,9.49 U$32.3 253.82,16.33 CAMERA1.P$2
  other vias: -90.81,41.91 -87,40.64 -87,41.91 -85.72,40.64 -87,46.99 -87,48.26 -88.27,48.26 -83.19,40.64 -84.45,40.64 -83.19,45.72 -83.19,46.99 -83.19,48.26 -81.92,40.64 -81.92,46.99 -81.92,48.26 -81.92,49.53 -80.64,49.53 -80.64,-3.81 -80.64,-5.08 -76.83,-3.81 -76.83,-5.08 -75.56,-5.08 -74.3,-5.08 -73.03,-5.08 -71.75,-5.08 -73.03,1.27 -73.03,2.54 -71.75,2.54 -71.75,1.27 -71.75,3.81 -71.75,5.08 -76.83,1.27 -76.83,2.54 -78.11,2.54 39.37,8.89
  pour Bottom (isolate 0.305, rank 6): -7.62,130.81 264.16,130.81 264.16,-3.81 -7.62,-3.81
  pour Top (isolate 0.254, rank 6): -91.44,39.37 -91.44,50.8 -78.74,50.8 -78.74,39.37
  pour Top (isolate 0.254, rank 6): -82.55,-6.35 -82.55,6.35 -68.58,6.35 -68.58,-6.35
N$1  (1 unrouted)
N$4  (7 unrouted)
N$8  (1 unrouted)
N$9  (4 unrouted)
N$10  (1 unrouted)
N$11
  Top 0.406: U$2.P$6 -66.67,45.94 C3.1
N$12
  Top 0.406: U$8.P$6 177.16,35.34 C9.1
N$13
  Top 0.406: U$4.P$6 177.16,21.38 C6.1
N$14  (1 unrouted)
N$15
  pour Top (isolate 0.305, rank 2): 186.69,8.89 186.69,14.86 176.53,14.86 176.53,8.89
N$16  (1 unrouted)
N$17
  pour Top (isolate 0.305, rank 2): 186.69,22.86 186.69,28.83 176.53,28.83 176.53,22.86
N$18
  Top 0.406: U$11.P$6 177.16,49.31 C12.1
N$19  (1 unrouted)
N$20
  pour Top (isolate 0.305, rank 2): 186.69,36.83 186.69,42.8 176.53,42.8 176.53,36.83
N$21
  Top 0.406: U$14.P$6 177.16,63.28 C15.1
N$22  (1 unrouted)
N$23  (1 unrouted)
N$24
  pour Top (isolate 0.305, rank 2): 186.69,50.8 186.69,56.77 176.53,56.77 176.53,50.8
N$25
  Top 0.406: U$17.P$6 177.16,76.83 176.53,77.47 C18.1
N$26  (2 unrouted)
N$27
  pour Top (isolate 0.305, rank 2): 186.69,64.77 186.82,70.74 176.66,70.74 176.53,64.77
N$28
  Top 0.406: U$23.P$6 177.16,91.22 C29.1
N$29  (1 unrouted)
N$30
  pour Top (isolate 0.305, rank 2): 186.69,78.74 186.69,84.58 176.53,84.58 176.53,78.74
N$31
  Top 0.406: U$29.P$6 177.16,105.19 C37.1
N$32
  pour Top (isolate 0.305): -80.01,-11.43 -80.01,-6.35 -79.38,-6.35 -79.38,-3.81 -78.11,-3.81 -78.11,-6.35 -76.2,-6.35 -76.2,-11.43
N$33
  Top 0.406: U$19.P$6 -43.81,77.69 C20.1
N$34  (3 unrouted)
N$35  (2 unrouted)
N$36  (2 unrouted)
N$37
  pour Top (isolate 0.305, rank 2): 186.69,92.71 186.69,98.55 176.53,98.55 176.53,92.71
N$38
  Top 0.305: U$39.P$6 177.16,119.17 C57.1
N$39  (2 unrouted)
N$40
  pour Top (isolate 0.305): -90.17,34.29 -90.17,39.37 -89.53,39.37 -89.53,41.91 -88.27,41.91 -88.27,39.37 -86.36,39.37 -86.36,34.29
N$41  (1 unrouted)
N$42  (1 unrouted)
N$43  (1 unrouted)
N$44  (1 unrouted)
N$45  (2 unrouted)
N$46  (2 unrouted)
N$47
  pour Top (isolate 0.305, rank 2): 186.69,106.68 186.69,112.65 176.53,112.65 176.53,106.68
N$48  (1 unrouted)
N$49
  Top 0.406: 12V_VOLTAGE.P$2 -44.77,-0.11 R25.2 -45.42,-0.08 12V_VOLTAGE.P$1
N$50  (2 unrouted)
N$51  (2 unrouted)
N$52
  Top 0.305: U$35.P$6 -59.05,8.68 C31.1
N$53
  Top 0.406: V-THRUST_CURR_ADC.P$4 -44.78,80.32 -44.78,79.46 -45.09,79.15 U$19.P$7
N$54  (2 unrouted)
N$55
  pour Top (isolate 0.305): -66.67,40.01 -56.52,40.01 -56.52,34.29 -66.67,34.29
N$56
  pour Top (isolate 0.305, rank 2): -60.96,1.27 -54.61,1.27 -54.61,-10.16 -60.96,-10.16
N$57
  Top 0.406: U$2.P$7 -67.94,48.9 -67.02,49.83 5V_CURR_ADC.P$4
N$58
  Top 0.406: V-THRUST_VOLTAGE.P$2 -35.88,76.72 R30.2 -36.53,76.75 V-THRUST_VOLTAGE.P$1
N$60
  Top 0.305: U$35.P$7 -60.33,4.45 -59.69,3.81 -57.15,3.81 -56.35,4.61 -56.35,5.86 -54.98,7.24 -54.24,7.24 -53.05,6.04 12V_CURR_ADC.P$4
N$62  (3 unrouted)
N$63  (1 unrouted)
N$64  (2 unrouted)
N$65  (2 unrouted)
N$66  (1 unrouted)
N$67  (2 unrouted)
N$68  (2 unrouted)
N$69  (1 unrouted)
N$70  (1 unrouted)
N$71
  Top 0.406: R31.1 5V_LED.P$1
N$72
  Top 0.61: R32.1 V-THRUST_LED.P$1
N$73
  Top 0.406: 12V_LED.P$1 R33.1
N$74
  Top 0.305: R34.1 3V3_LED.P$1
N$75  (1 unrouted)
N$76  (1 unrouted)
N$77
  Top 0.305: -55.24,50.46 R35.2 | -55.24,50.46 5V_VOLTAGE.P$2 | 5V_VOLTAGE.P$1 -55.55,50.77 -55.24,50.46
N$80  (2 unrouted)
N$81  (2 unrouted)
N$82  (2 unrouted)
N$83  (2 unrouted)
N$84  (2 unrouted)
N$85  (2 unrouted)
N$86  (1 unrouted)
N$87  (1 unrouted)
N$88  (1 unrouted)
N$89  (1 unrouted)
SCL  (via drill 0.55, 0.6)  (10 unrouted)
  Top 0.254: -65.06,51.77 5V_CURR_ADC.P$1 -67.61,51.77 v-68.58,50.8 | THRUSTER_CURR_ADC.14 149.56,46.02 v148.59,46.99 | v142.24,43.18 134.62,43.18
  Bottom 0.254: v-68.58,50.8 -67.31,49.53 | v148.59,46.99 146.05,46.99 v142.24,43.18
SCL-3V3  (2 unrouted)
  Top 0.254: 134.11,-40.34 134.41,-40.65 134.63,-40.65 134.91,-40.94 BME280.P$4 134.91,-43.18 134.28,-43.81 R11.1 | 264.45,-26.38 DEPTH_SENS.P$1 265.09,-25.74
SDA  (via drill 0.45)  (10 unrouted)
  Top 0.254: V-THRUST_CURR_ADC.P$8 -46.7,86.66 v-45.72,87.63
  Bottom 0.254: v-45.72,87.63 -41.85,87.63 -41,86.77
SDA-3V3  (2 unrouted)
  Top 0.254: 134.12,-39.71 134.6,-40.2 135.44,-40.2 135.56,-40.31 BME280.P$3 135.56,-45.4 135.89,-45.72 140.55,-45.72 R10.1
SHDN_SW  (4 unrouted)
T1_CURR
  Top 0.406: U$4.P$7 175.9,19.68 173.99,21.59 172.72,21.59 168.91,25.4 168.91,34.7 168.3,35.31 168.3,42.52 166.1,44.72 THRUSTER_CURR_ADC.1
T1_PWM
  Top 0.406: THRUST1.P$2 195.58,14.66 197.26,16.33 197.26,28.75 201.52,33.02 201.52,119.3 200,120.83 200,120.9 195.83,125.07 168.91,125.07 | U1.6 161.16,76.5 158.05,79.61 158.05,83.82 | 168.91,125.07 168.56,125.07 | 158.05,83.82 158.05,84.59 | 168.91,125.07 168.86,125.02 168.51,125.02 158.05,114.55 158.05,84.59 | 158.05,84.59 158.05,83.82
T2_CURR
  Top 0.406: U$8.P$7 175.9,33.66 173.99,35.56 170.18,35.56 168.91,36.83 168.91,43.18 166.72,45.37 THRUSTER_CURR_ADC.2
T2_PWM
  Top 0.406: THRUST2.P$2 200.91,33.27 200.91,119.05 199.39,120.57 199.39,120.65 195.58,124.46 185.42,124.46 185.37,124.41 168.77,124.41 158.66,114.3 158.66,83.82 | U1.7 161.37,77.14 158.66,79.86 158.66,83.82 | 158.66,84.34 158.66,83.82
T3_CURR
  Top 0.406: U$11.P$7 175.9,47.62 173.99,49.53 171.45,49.53 167.94,46.02 THRUSTER_CURR_ADC.3
T3_PWM
  Top 0.406: THRUST3.P$2 200.3,46.63 200.3,118.8 195.3,123.8 169.02,123.8 159.27,114.05 159.27,85.09 | U1.8 161.59,77.8 159.27,80.11 159.27,85.09 | 159.27,85.09 159.27,84.59
T4_CURR
  Top 0.406: U$14.P$7 175.9,61.59 173.99,63.5 171.45,63.5 169.52,61.57 169.52,60.3 168.91,59.69 168.91,48.26 167.31,46.66 THRUSTER_CURR_ADC.4
T4_PWM
  Top 0.406: THRUST4.P$2 199.69,59.99 199.69,118.54 195.05,123.19 185.42,123.19 185.37,123.14 169.22,123.14 159.88,113.79 159.88,80.37 161.8,78.44 U1.9
T5_CURR
  Top 0.406: U$17.P$7 175.9,75.56 173.99,77.47 171.45,77.47 168.91,74.93 168.91,60.55 168.3,59.94 168.3,48.51 167.1,47.31 THRUSTER_CURR_ADC.5
T5_PWM
  Top 0.406: THRUST5.P$2 199.09,73.36 199.09,118.29 194.85,122.53 169.47,122.53 160.49,113.54 160.49,80.62 162.01,79.09 U1.10
T6_CURR
  Top 0.406: U$23.P$7 175.9,89.53 173.99,91.44 171.45,91.44 167.64,87.63 167.64,48.71 166.89,47.97 THRUSTER_CURR_ADC.6
T6_PWM
  Top 0.406: THRUST6.P$2 198.48,86.72 198.48,118.04 194.59,121.92 170.18,121.92 | U1.11 162.22,79.75 161.09,80.87 161.09,82.55 | 170.18,121.92 169.73,121.92 | 161.09,82.55 161.09,83.22 | 170.18,121.92 170.13,121.87 169.68,121.87 161.09,113.29 161.09,82.55
T7_CURR
  Top 0.406: U$29.P$7 175.9,103.5 173.99,105.41 170.18,105.41 166.37,101.6 166.37,50.8 164.19,48.62 THRUSTER_CURR_ADC.7
T7_PWM
  Top 0.406: THRUST7.P$2 197.87,100.08 197.87,117.79 194.39,121.26 170.18,121.26 | 161.7,82.55 161.7,82.96 | 161.7,82.55 161.7,81.12 162.43,80.39 U1.12 | 169.93,121.26 170.18,121.26 | 170.18,121.26 169.93,121.26 | 161.7,82.55 161.7,113.04 169.93,121.26
T8_CURR
  Top 0.406: U$39.P$7 175.9,117.47 173.99,119.38 170.18,119.38 167.64,116.84 167.64,103.73 165.76,101.85 165.76,51.16 163.83,49.23 163.79,49.27 THRUSTER_CURR_ADC.8
T8_PWM
  Top 0.406: U1.13 162.65,81.05 162.31,81.38 162.31,112.78 170.18,120.65 194.14,120.65 197.26,117.53 197.26,113.44 THRUST8.P$2
V_BATT1  (16 unrouted)
V_BATT2  (14 unrouted)
V_RELAY  (3 unrouted)
V_THRUST  (via drill 0.65)  (74 unrouted)
  Top 1.27: V-THRUST_OUT.P$1 285.93,16.33 | C47.1 270.69,9.49 U$33.1 270.51,11.61 CAMERA2.P$1 | CAMERA1.P$1 256.72,16.33 U$32.1 256.72,9.49 C46.1
  Bottom 2.032: v172.72,68.58 171.45,68.58 170.18,67.31 170.18,64.77 168.91,63.5 147.32,63.5 | v172.72,54.61 170.18,57.15 170.18,59.69 168.91,60.96 137.76,60.96 140.3,58.42 165.1,58.42 168.91,54.61 168.91,44.45 v172.72,40.64 | v172.72,82.55 168.91,78.74 168.91,69.85 165.1,66.04 138.43,66.04 | 152.4,68.58 138.43,67.31 139.7,68.58 163.83,68.58 166.37,71.12 166.37,88.9 172.72,95.25 v172.72,96.52 | v172.72,26.67 172.72,31.75 166.37,38.1 166.37,53.34 163.83,55.88 137.16,55.88 137.16,60.36 | 137.16,54.61 138.43,53.34 162.56,53.34 163.83,52.07 163.83,36.83 168.91,31.75 168.91,17.78 172.72,13.97 v172.72,12.7 | v172.72,110.49 172.72,109.22 163.83,100.33 163.83,72.39 162.56,71.12 152.4,71.12 151.13,69.85 137.16,64.1
  other vias: 175.26,112.39 172.72,112.39 172.72,108.58 175.26,108.58 175.26,56.52 172.72,56.52 172.72,52.7 175.26,52.7 175.26,42.55 172.72,42.55 172.72,38.73 175.26,38.73 175.26,28.57 172.72,28.57 172.72,24.77 175.26,24.77 175.26,14.61 172.72,14.61 172.72,10.79 175.26,10.79 175.26,84.45 172.72,84.45 172.72,80.64 175.26,80.64 175.26,98.42 172.72,98.42 172.72,94.61 175.26,94.61 175.26,70.48 172.72,70.48 172.72,66.67 175.26,66.67
  pour Top (isolate 0.305): 176.28,113.03 176.28,107.95 171.45,107.95 171.45,113.03
  pour Top (isolate 0.305): 176.28,113.03 176.28,107.95 171.45,107.95 171.45,113.03
  pour Top (isolate 0.305): 176.28,99.06 176.28,93.98 171.45,93.98 171.45,99.06
  pour Top (isolate 0.305): 176.28,85.09 176.28,80.01 171.45,80.01 171.45,85.09
  pour Top (isolate 0.305): 176.28,71.12 176.28,66.04 171.45,66.04 171.45,71.12
  pour Top (isolate 0.305): 176.28,57.15 176.28,52.07 171.45,52.07 171.45,57.15
  pour Top (isolate 0.305): 176.28,43.18 176.28,38.1 171.45,38.1 171.45,43.18
  pour Top (isolate 0.305): 176.28,29.21 176.28,24.13 171.45,24.13 171.45,29.21
  pour Top (isolate 0.305): 176.28,15.24 176.28,10.16 171.45,10.16 171.45,15.24
  pour Bottom (isolate 0.406, rank 2): 137.16,72.39 162.56,72.39 162.56,52.07 137.16,52.07
  pour Bottom (isolate 0.305): 171.45,113.03 176.53,113.03 176.53,107.95 171.45,107.95
  pour Bottom (isolate 0.305): 171.45,99.06 176.53,99.06 176.53,93.98 171.45,93.98
  pour Bottom (isolate 0.305): 171.45,85.09 176.53,85.09 176.53,80.01 171.45,80.01
  pour Bottom (isolate 0.305): 171.45,71.12 176.53,71.12 176.53,66.04 171.45,66.04
  pour Bottom (isolate 0.305): 171.45,57.15 176.53,57.15 176.53,52.07 171.45,52.07
  pour Bottom (isolate 0.305): 171.45,43.18 176.53,43.18 176.53,38.1 171.45,38.1
  pour Bottom (isolate 0.305): 171.45,29.21 176.53,29.21 176.53,24.13 171.45,24.13
  pour Bottom (isolate 0.305): 171.45,15.24 176.53,15.24 176.53,10.16 171.45,10.16
  pour Top (isolate 0.305): 176.28,71.12 176.28,66.04 171.45,66.04 171.45,71.12
V_THRUST1
  Top 2.54: THRUST1.P$4 192.86,19.05 U$31.1 187.78,16.69 186.69,17.78
  pour Top (isolate 0.305, rank 3): 179.07,21.59 179.07,15.24 187.96,15.24 187.96,21.59
V_THRUST2  (4 unrouted)
  Top 0.406: U$30.1 190.5,30.48
  Top 2.54: THRUST2.P$4 193.04,33.02 190.5,30.48 | U$30.1 187.78,30.66 186.69,31.75
  pour Top (isolate 0.305, rank 3): 179.07,35.56 179.07,29.21 187.96,29.21 187.96,35.56
V_THRUST3  (2 unrouted)
  Top 2.54: THRUST3.P$4 192.86,46.99 U$26.1 187.78,44.63 186.69,45.72
  pour Top (isolate 0.305, rank 3): 179.07,49.53 179.07,43.18 187.96,43.18 187.96,49.53
V_THRUST4  (2 unrouted)
  Top 2.54: THRUST4.P$4 192.86,60.96 U$28.1 187.78,58.6 186.69,59.69
  pour Top (isolate 0.305, rank 3): 179.07,63.5 179.07,57.15 187.96,57.15 187.96,63.5
V_THRUST5  (2 unrouted)
  Top 2.54: THRUST5.P$4 192.86,74.93 U$22.1 187.78,72.57 186.69,73.66
  pour Top (isolate 0.305, rank 3): 179.07,77.47 179.07,71.12 187.96,71.12 187.96,77.47
V_THRUST6  (2 unrouted)
  Top 2.54: THRUST6.P$4 192.86,88.9 U$13.1 187.78,86.54 186.69,87.63
  pour Top (isolate 0.305, rank 3): 179.07,91.44 179.07,85.09 187.96,85.09 187.96,91.44
V_THRUST7  (2 unrouted)
  Top 2.54: THRUST7.P$4 192.86,102.87 U$16.1 187.78,100.51 186.69,101.6
  pour Top (isolate 0.305, rank 3): 179.07,105.41 179.07,99.06 187.96,99.06 187.96,105.41
V_THRUST8  (2 unrouted)
  Top 2.54: THRUST8.P$4 191.59,116.84 U$10.1 190.32,115.57 187.96,115.57
  pour Top (isolate 0.305, rank 3): 179.07,119.38 179.07,113.03 187.96,113.03 187.96,119.38
VIN  (via drill 0.55)  (19 unrouted)
  other vias: -73.03,-3.17
  pour Top (isolate 0.305): -83.82,41.91 -83.82,44.45 -81.28,44.45 -81.28,41.91
  pour Top (isolate 0.305): -73.66,-3.81 -73.66,-1.27 -71.12,-1.27 -71.12,-3.81
  pour Top: 69.85,15.24 64.14,15.24 64.14,11.43 69.85,11.43
(copper drawn outside any net)
  shapes: Top area x5

## Text on the board
tPlace: Qubo Jr. Support Board / Rev. 3 | Designed By: / Ben Hurwitz and Alex Jiao / Robotics at Maryland, 2017 | V+ | GND | PWM | GND | Thrust 8 | V+ | GND | PWM | GND | Thrust 7 | V+ | Reset held high. | GND | PWM | GND | Thrust 6 | INPUT | V+ | Tiva-C | GND | 13-20V | PWM | GND | Thrust 5 | GND | V+ | GND | PWM | V_Thrust | GND | Thrust 4 | V+ | GND | PWM | GND | RED LED | Thrust 3 | GREEN LED | 5V Rail FAIL | 5V Rail ON | V+ | 5V Rail | GND | PWM | GND | Thrust 2 | GND | GND | GND | 13-20V | 13-20V | 13-20V | V+ | GREEN LED | GND | PWM | 12V Rail FAIL | GND | Thrust 1 | RED LED | V_Thrust ON | CPU PWR | GND | 12V | 12V | GND | GND | 12V Rail ON/OFF | 12V | GND | GND | 5V | 12V Rail ON / (Jumper) | GREEN LED | 5V | 12V Rail | 12V Rail ON | SCL | SDA | GND | 5V | GND | 5V | Depth | GREEN LED | 3V3 Rail ON